# Altium schematic sheet STM32.SchDoc: Icarus MCU
size 431 x 279 mm; Date: 12/1/2022; DrawnBy: J. Sullivan; SheetNumber: 3; SheetTotal: 13; ENG_APP_DATE: 12/01/2022; DSN_APP_DATE: --/--/--; CHK_APP_DATE: --/--/--; SPICEModelCacheYFKOITNE: <root> / <DocumentId>YFKOITNE</DocumentId> / </root>
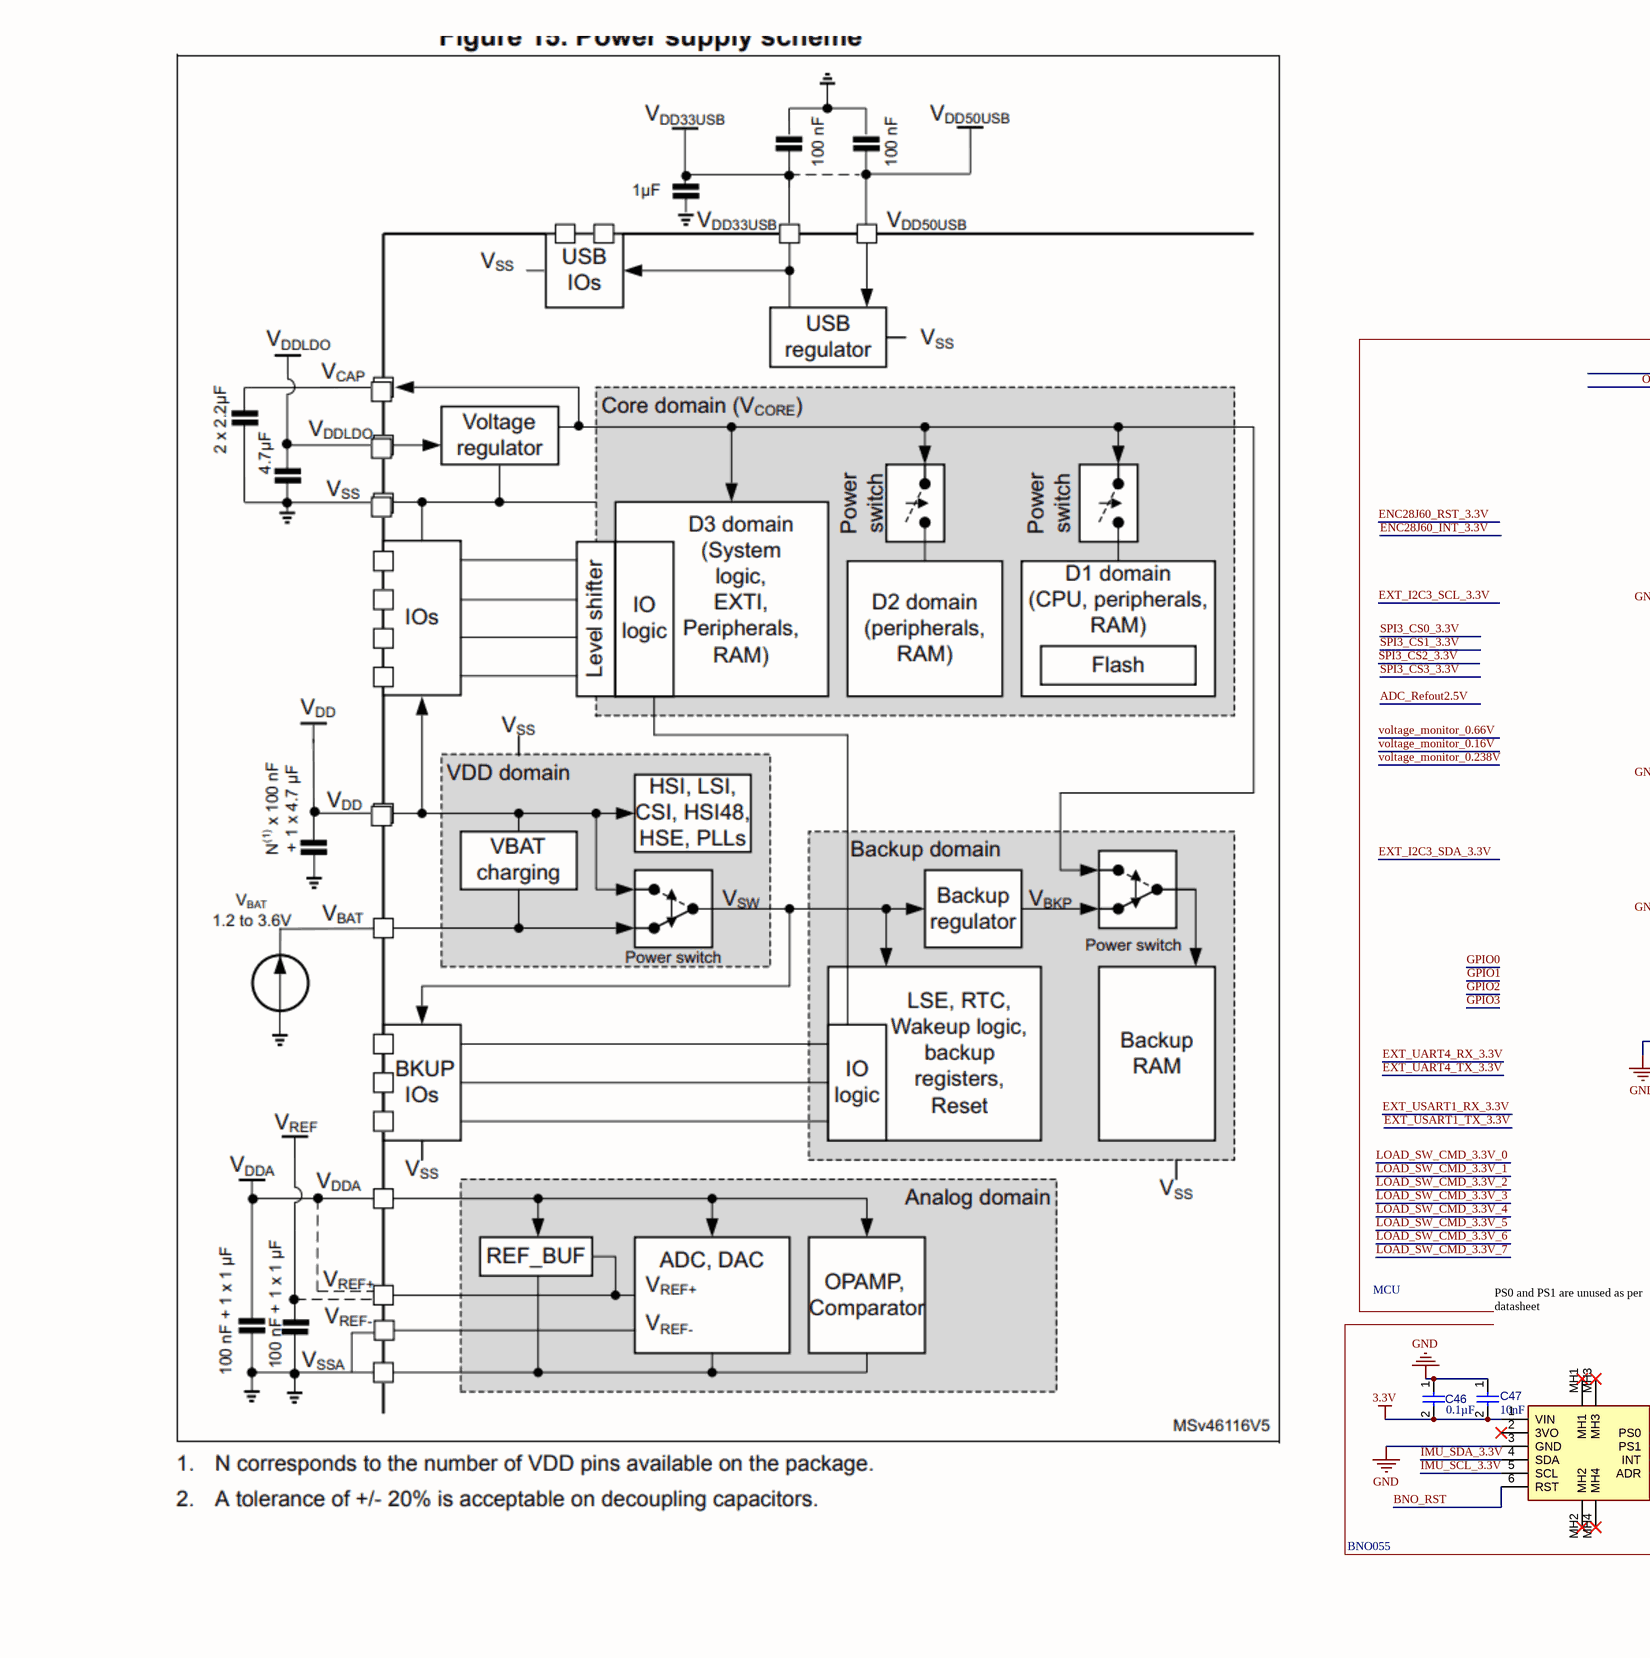
[diagram p0: STM32.SchDoc, left]
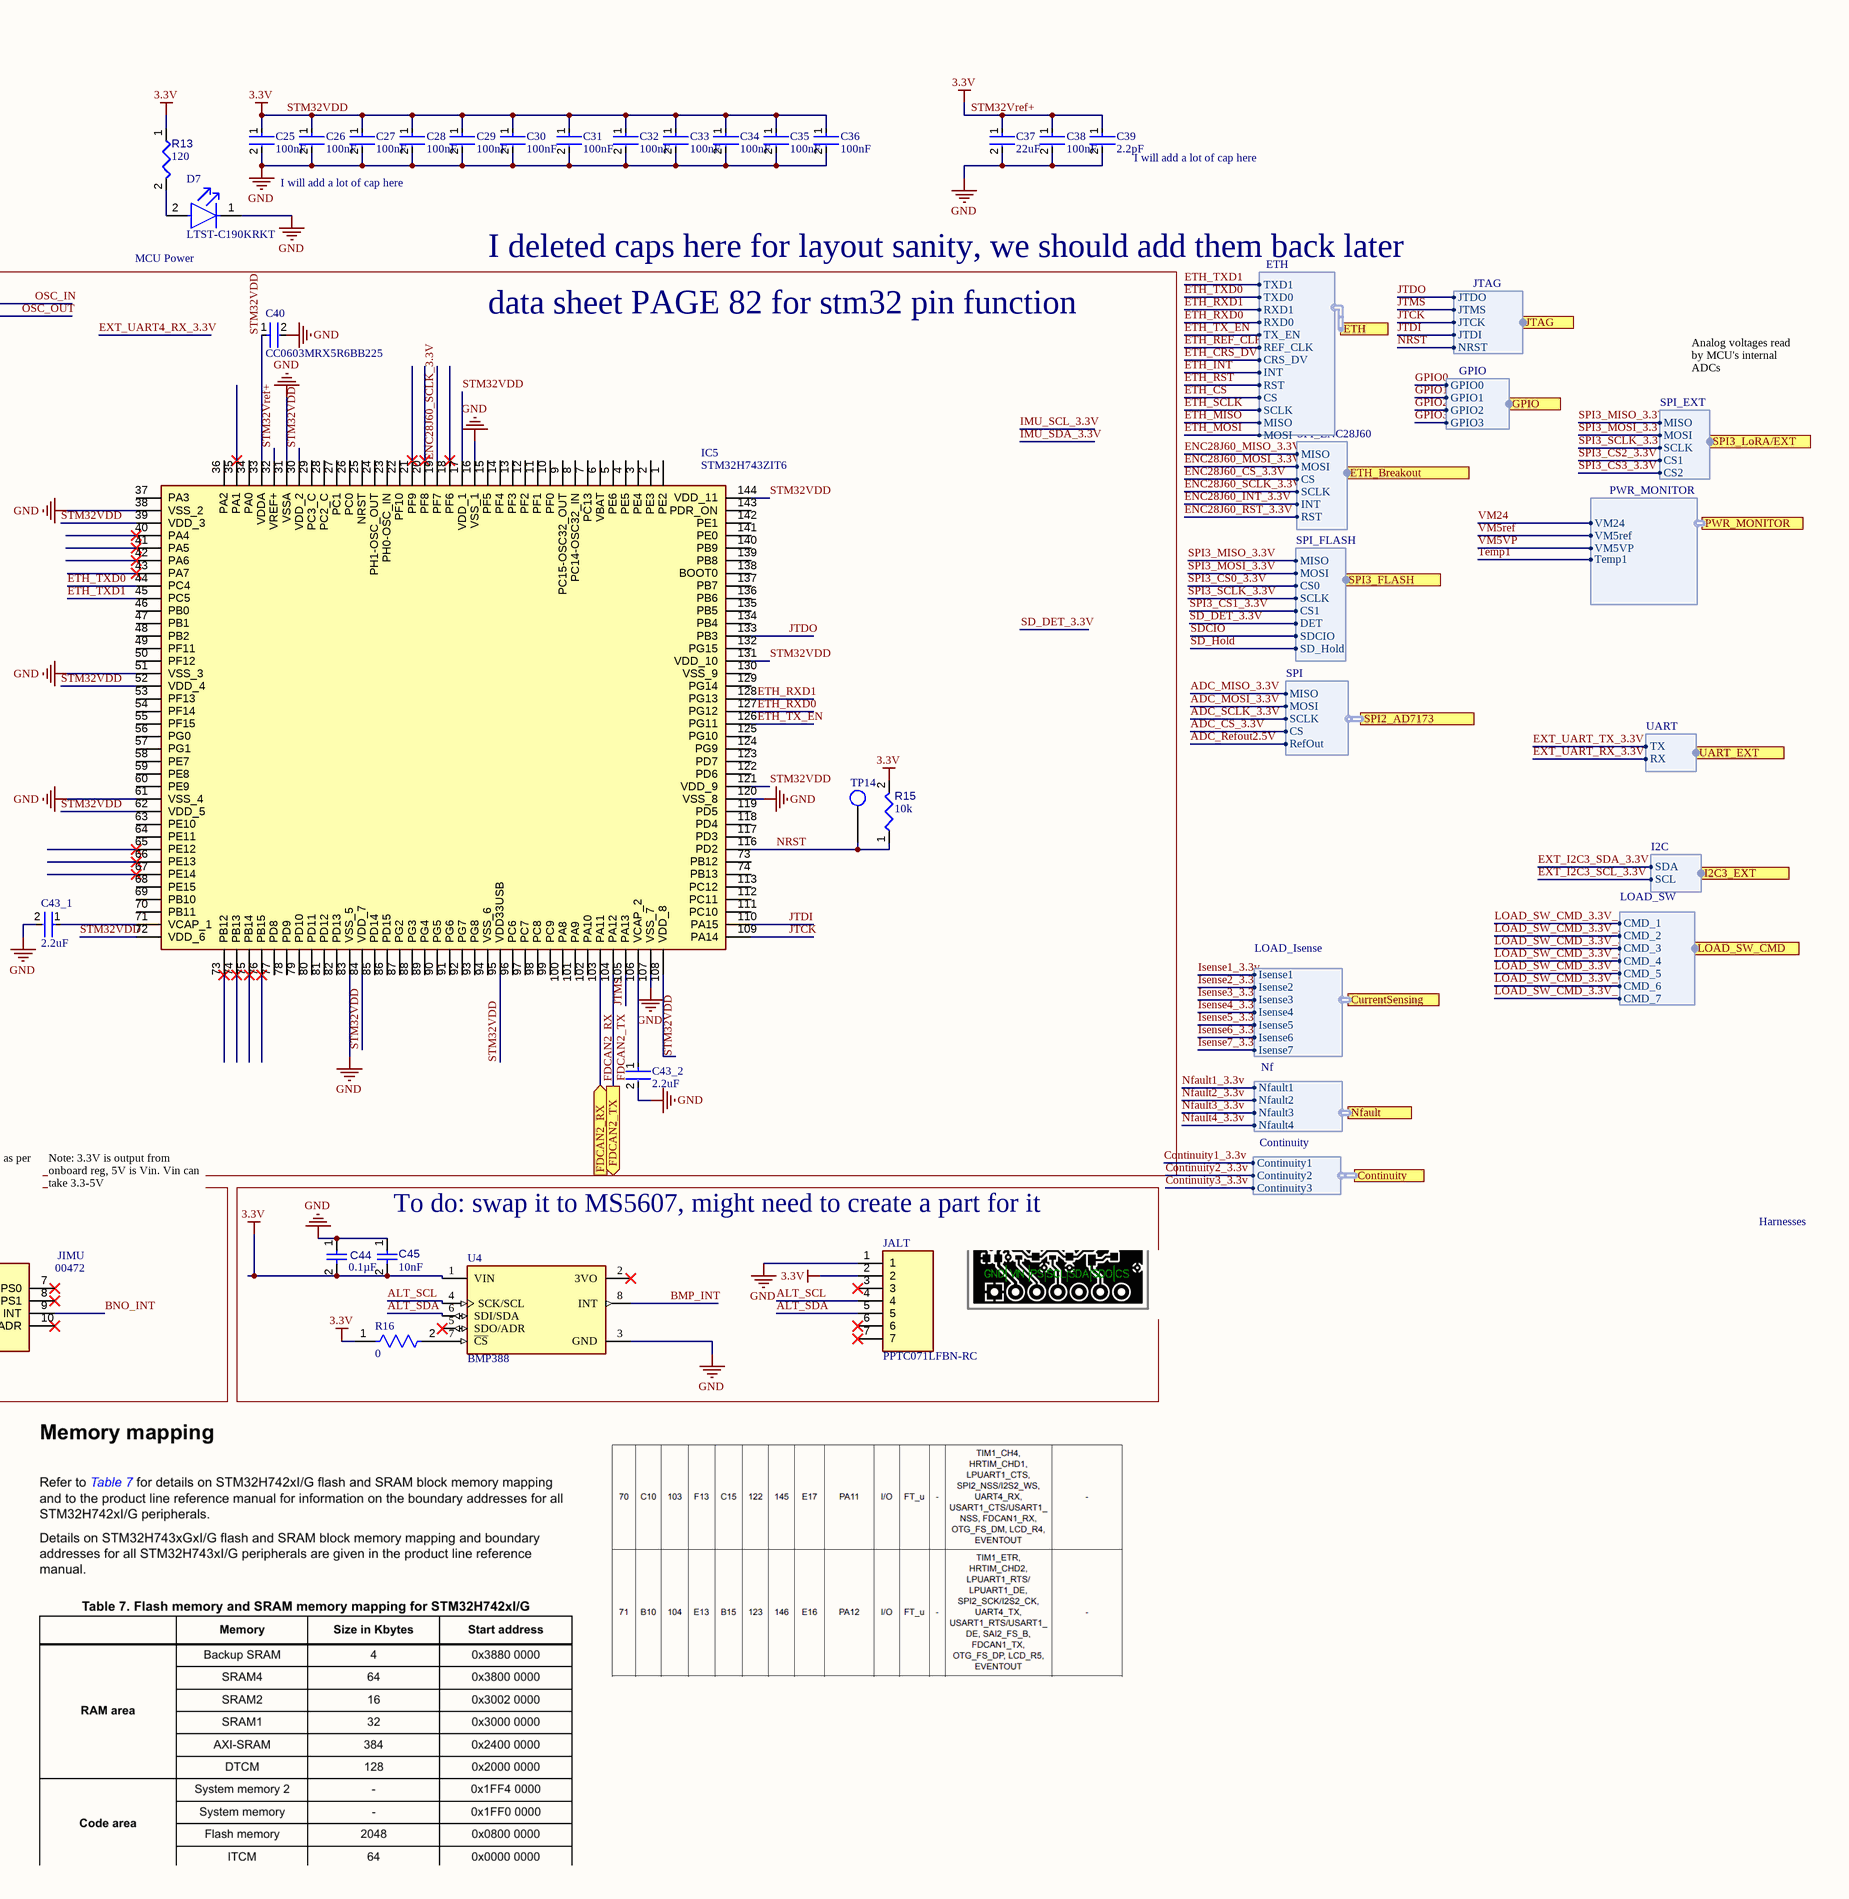
[diagram p1: STM32.SchDoc, right]

## Parts
C25  100nF  [FP-CC0402-MFG]
C26  100nF  [FP-CC0402-MFG]
C27  100nF  [FP-CC0402-MFG]
C28  100nF  [FP-CC0402-MFG]
C29  100nF  [FP-CC0402-MFG]
C30  100nF  [FP-CC0402-MFG]
C31  100nF  [FP-CC0402-MFG]
C32  100nF  [FP-CC0402-MFG]
C33  100nF  [FP-CC0402-MFG]
C34  100nF  [FP-CC0402-MFG]
C35  100nF  [FP-CC0402-MFG]
C36  100nF  [FP-CC0402-MFG]
C37  22uF  [FP-CC0603-DA-MFG]
C38  100nF  [FP-CGA3E-0_3-0_1-IPC_A]
C39  2.2pF  [FP-C0603C-CF-MFG]
C40  CC0603MRX5R6BB225  [FP-CC0603-DA-MFG]
C43_1  2.2uF  [FP-CC0603-DA-MFG]
C43_2  2.2uF  [FP-CC0603-DA-MFG]
C44  value 0.1µF  [CAPC1608X90X40LL10T20]  (hidden comment: Capacitor 1 uF +/- 10% 25 V 0603)
C45  value 10nF  [CAPC1608X90X40NL10T20]  (hidden comment: Capacitor 100 nF +/-10% 50 V 0603)
C46  value 0.1µF  [CAPC1608X90X40LL10T20]  (hidden comment: Capacitor 1 uF +/- 10% 25 V 0603)
C47  value 10nF  [CAPC1608X90X40NL10T20]  (hidden comment: Capacitor 100 nF +/-10% 50 V 0603)
D7  LTST-C190KRKT  [FP-LTST-C190KRKT-MFG]
IC5  STM32H743ZIT6  [QFP50P2200X2200X160-144N]
JALT  PPTC071LFBN-RC  [RHDR7W80P0X254_1X7_1828X254X870P]
JIMU  00472  [00472]
R13  value 120  [RESC1609X50X30ML08T20]  (hidden comment: Resistor 20R +/-1% 0603 100 mW)
R15  value 10k  [RESC0402(1005)_L]  (hidden comment: 10KR2F)
R16  0  [FP-CRCW1206-e3-MFG]
TP14  BURPG_TestPoint1  [BURPG_TestPoint1]  (value not drawn)  (no BOM)
U4  BMP388  [FP-3966-MFG]

## Blocks framed on the sheet
data sheet PAGE 82 for stm32 pin function: C40 C43_1 C43_2 IC5 R15 TP14
BNO055: C46 C47 JIMU
To do: swap it to MS5607, might need to create a part for it: C44 C45 JALT R16 U4

## Ports
Continuity (harness Continuity), CurrentSensing (harness LOAD_Isense), ETH (harness ETH), ETH_Breakout (harness SPI_ENC28J60), FDCAN2_RX (in), FDCAN2_TX (out), GPIO (harness GPIO), I2C3_EXT (harness I2C), JTAG (harness JTAG), LOAD_SW_CMD (harness LOAD_SW), Nfault (harness Nf), PWR_MONITOR (harness PWR_MONITOR), SPI2_AD7173 (harness SPI), SPI3_FLASH (harness SPI_FLASH), SPI3_LoRA/EXT (harness SPI_EXT), UART_EXT (harness UART)

## Harnesses
JTAG: JTDO, JTMS, JTCK, JTDI, NRST
UART: TX, RX
SPI_ENC28J60: MISO, MOSI, CS, SCLK, INT, RST
LOAD_SW: CMD_1, CMD_2, CMD_3, CMD_4, CMD_5, CMD_6, CMD_7
I2C: SDA, SCL
SPI_EXT: MISO, MOSI, CS1, SCLK, CS2
PWR_MONITOR: VM24, VM5ref, VM5VP, Temp1
GPIO: GPIO0, GPIO1, GPIO2, GPIO3
SPI_FLASH: MISO, MOSI, CS0, SCLK, CS1, DET, SDCIO, SD_Hold
SPI: MISO, MOSI, CS, SCLK, RefOut
LOAD_Isense: Isense1, Isense2, Isense3, Isense4, Isense5, Isense6, Isense7
Nf: Nfault1, Nfault2, Nfault3, Nfault4
Continuity: Continuity1, Continuity2, Continuity3
ETH: RXD0, RXD1, TXD0, TXD1, TX_EN, REF_CLK, CRS_DV, INT, RST, CS, SCLK, MISO, MOSI

## Nets
GND: C25.2 C26.2 C27.2 C28.2 C29.2 C30.2 C31.2 C32.2 C33.2 C34.2 C35.2 C36.2 C37.2 C38.2 C39.2 C40.2 C43_1.2 C43_2.2 C44.1 C45.1 C46.1 C47.1 D7.1(C) IC5.16(VSS_1) IC5.31(VSSA) IC5.38(VSS_2) IC5.51(VSS_3) IC5.61(VSS_4) IC5.83(VSS_5) IC5.107(VSS_7) IC5.120(VSS_8) JALT.1 JIMU.3(GND) U4.3(GND)
STM32VDD: C25.1 C26.1 C27.1 C28.1 C29.1 C30.1 C31.1 C32.1 C33.1 C34.1 C35.1 C36.1 C37.1 C38.1 C39.1 C40.1 C44.2 C45.2 C46.2 C47.2 IC5.17(VDD_1) IC5.30(VDD_2) IC5.32(VREF+) IC5.33(VDDA) IC5.39(VDD_3) IC5.52(VDD_4) IC5.62(VDD_5) IC5.72(VDD_6) IC5.84(VDD_7) IC5.95(VDD33USB) IC5.108(VDD_8) IC5.121(VDD_9) IC5.131(VDD_10) IC5.144(VDD_11) JALT.2 JIMU.1(VIN) R13.1 R15.2 R16.1 U4.1(VIN)  [also labelled 3.3V, STM32Vref+]
ADC_CS_3.3V: port SPI2_AD7173.CS
ADC_MISO_3.3V: port SPI2_AD7173.MISO
ADC_MOSI_3.3V: port SPI2_AD7173.MOSI
ADC_Refout2.5V: port SPI2_AD7173.RefOut
ADC_SCLK_3.3V: port SPI2_AD7173.SCLK
ALT_SCL: JALT.4 U4.4(SCK/SCL)
ALT_SDA: JALT.5 U4.6(SDI/SDA)
BMP_INT: U4.8(INT)
BNO_INT: JIMU.9(INT)
BNO_RST: JIMU.6(RST)
Continuity1_3.3v: port Continuity.Continuity1
Continuity2_3.3v: port Continuity.Continuity2
Continuity3_3.3v: port Continuity.Continuity3
ENC28J60_CS_3.3V: port ETH_Breakout.CS
ENC28J60_INT_3.3V: port ETH_Breakout.INT
ENC28J60_MISO_3.3V: port ETH_Breakout.MISO
ENC28J60_MOSI_3.3V: port ETH_Breakout.MOSI
ENC28J60_RST_3.3V: port ETH_Breakout.RST
ENC28J60_SCLK_3.3V: IC5.19(PF7) ; port ETH_Breakout.SCLK
ETH_CRS_DV: port ETH.CRS_DV
ETH_CS: port ETH.CS
ETH_INT: port ETH.INT
ETH_MISO: port ETH.MISO
ETH_MOSI: port ETH.MOSI
ETH_REF_CLK: port ETH.REF_CLK
ETH_RST: port ETH.RST
ETH_RXD0: IC5.127(PG12) ; port ETH.RXD0
ETH_RXD1: IC5.128(PG13) ; port ETH.RXD1
ETH_SCLK: port ETH.SCLK
ETH_TX_EN: IC5.126(PG11) ; port ETH.TX_EN
ETH_TXD0: IC5.44(PC4) ; port ETH.TXD0
ETH_TXD1: IC5.45(PC5) ; port ETH.TXD1
EXT_I2C3_SCL_3.3V: port I2C3_EXT.SCL
EXT_I2C3_SDA_3.3V: port I2C3_EXT.SDA
EXT_UART_RX_3.3V: port UART_EXT.RX
EXT_UART_TX_3.3V: port UART_EXT.TX
FDCAN2_RX: IC5.103(PA11) ; port FDCAN2_RX
FDCAN2_TX: IC5.104(PA12) ; port FDCAN2_TX
GPIO0: port GPIO.GPIO0
GPIO1: port GPIO.GPIO1
GPIO2: port GPIO.GPIO2
GPIO3: port GPIO.GPIO3
IMU_SCL_3.3V: JIMU.5(SCL)
IMU_SDA_3.3V: JIMU.4(SDA)
Isense1_3.3v: port CurrentSensing.Isense1
Isense2_3.3v: port CurrentSensing.Isense2
Isense3_3.3v: port CurrentSensing.Isense3
Isense4_3.3v: port CurrentSensing.Isense4
Isense5_3.3v: port CurrentSensing.Isense5
Isense6_3.3v: port CurrentSensing.Isense6
Isense7_3.3v: port CurrentSensing.Isense7
JTCK: IC5.109(PA14) ; port JTAG.JTCK
JTDI: IC5.110(PA15) ; port JTAG.JTDI
JTDO: IC5.133(PB3) ; port JTAG.JTDO
JTMS: IC5.105(PA13) ; port JTAG.JTMS
LOAD_SW_CMD_3.3V_1: port LOAD_SW_CMD.CMD_1
LOAD_SW_CMD_3.3V_2: port LOAD_SW_CMD.CMD_2
LOAD_SW_CMD_3.3V_3: port LOAD_SW_CMD.CMD_3
LOAD_SW_CMD_3.3V_4: port LOAD_SW_CMD.CMD_4
LOAD_SW_CMD_3.3V_5: port LOAD_SW_CMD.CMD_5
LOAD_SW_CMD_3.3V_6: port LOAD_SW_CMD.CMD_6
LOAD_SW_CMD_3.3V_7: port LOAD_SW_CMD.CMD_7
Nfault1_3.3v: port Nfault.Nfault1
Nfault2_3.3v: port Nfault.Nfault2
Nfault3_3.3v: port Nfault.Nfault3
Nfault4_3.3v: port Nfault.Nfault4
NRST: IC5.116(PD2) R15.1 TP14.1 ; port JTAG.NRST
SD_DET_3.3V: port SPI3_FLASH.DET
SD_Hold: port SPI3_FLASH.SD_Hold
SDCIO: port SPI3_FLASH.SDCIO
SPI3_CS0_3.3V: port SPI3_FLASH.CS0
SPI3_CS1_3.3V: port SPI3_FLASH.CS1
SPI3_CS2_3.3V: port SPI3_LoRA/EXT.CS1
SPI3_CS3_3.3V: port SPI3_LoRA/EXT.CS2
SPI3_MISO_3.3V: port SPI3_LoRA/EXT.MISO, port SPI3_FLASH.MISO
SPI3_MOSI_3.3V: port SPI3_LoRA/EXT.MOSI, port SPI3_FLASH.MOSI
SPI3_SCLK_3.3V: port SPI3_LoRA/EXT.SCLK, port SPI3_FLASH.SCLK
Temp1: port PWR_MONITOR.Temp1
VM5ref: port PWR_MONITOR.VM5ref
VM5VP: port PWR_MONITOR.VM5VP
VM24: port PWR_MONITOR.VM24
NetC43_1_1: C43_1.1 IC5.71(VCAP_1)
NetC43_2_1: C43_2.1 IC5.106(VCAP_2)
NetD7_2: D7.2(A) R13.2
NetR16_2: R16.2 U4.7(~{CS})

Not connected (* = marked no-connect by the designer): IC5 1(PE2) 2(PE3) 3(PE4) 4(PE5) 5(PE6) 6(VBAT) 7(PC13) 8(PC14-OSC32_IN) 9(PC15-OSC32_OUT) 10(PF0) 11(PF1) 12(PF2) 13(PF3) 14(PF4) 15(PF5) 18(PF6)* 20(PF8)* 21(PF9)* 22(PF10) 23(PH0-OSC_IN) 24(PH1-OSC_OUT) 25(NRST) 26(PC0) 27(PC1) 28(PC2_C) 29(PC3_C) 34(PA0) 35(PA1)* 36(PA2) 37(PA3) 40(PA4)* 41(PA5)* 42(PA6)* 43(PA7)* 46(PB0) 47(PB1) 48(PB2) 49(PF11) 50(PF12) 53(PF13) 54(PF14) 55(PF15) 56(PG0) 57(PG1) 58(PE7) 59(PE8) 60(PE9) 63(PE10) 64(PE11) 65(PE12)* 66(PE13)* 67(PE14)* 68(PE15) 69(PB10) 70(PB11) 73(PB12)* 74(PB13)* 75(PB14)* 76(PB15)* 77(PD8) 78(PD9) 79(PD10) 80(PD11) 81(PD12) 82(PD13) 85(PD14) 86(PD15) 87(PG2) 88(PG3) 89(PG4) 90(PG5) 91(PG6) 92(PG7) 93(PG8) 94(VSS_6) 96(PC6) 97(PC7) 98(PC8) 99(PC9) 100(PA8) 101(PA9) 102(PA10) 111(PC10) 112(PC11) 113(PC12) 117(PD3) 118(PD4) 119(PD5) 122(PD6) 123(PD7) 124(PG9) 125(PG10) 129(PG14) 130(VSS_9) 132(PG15) 134(PB4) 135(PB5) 136(PB6) 137(PB7) 138(BOOT0) 139(PB8) 140(PB9) 141(PE0) 142(PE1) 143(PDR_ON); JALT 3* 6* 7*; JIMU 2(3VO)* 7(PS0)* 8(PS1)* 10(ADR)* MH1* MH2* MH3* MH4*; U4 2(3VO)* 5(SDO/ADR)*

## Notes on the sheet
- I will add a lot of cap here
- (near C39) I will add a lot of cap here
- (near D7) MCU Power
- I deleted caps here for layout sanity, we should add them back later
- Analog voltages read by MCU's internal ADCs
- MCU
- PS0 and PS1 are unused as per datasheet
- Note: 3.3V is output from onboard reg, 5V is Vin. Vin can take 3.3-5V
- Harnesses
- DWG. NO.
- REV.
- SHT.
- THIS DOCUMENT AND THE DATA DISCLOSED HEREIN OR HEREWITH IS THE PROPERTY OF ALTIUM LIMITED AND MAY BE FREELY DISTRIBUTED IN WHOLE. NO RIGHTS ARE RESERVED OR EXPRESS OR IMPLIED WARANTEE GIVEN.
- REVISION
- DESCRIPTION
- DATE
- APPROVED
- ENG:
- APPROVALS
- PROJECT
- DSN:
- CHK:
- REFERENCE DOCUMENTS
- PROJECT REVISION:
- TITLE
- DOCUMENT REVISION:
- DESIGN ITEM:
- BOM:
- FAB DWG:
- PCB DWG:
- ASSY DWG:
- SCALE:
- SIZE
- B
- CAGE CODE
- FILE NAME
- DWG NO.
- SHEET
- OF
- REV

## Library data of the parts
C25-C36 = CMP-03422-000048-1: CAP CER 0.1UF 16V X7R 0402; Manufacturer: YAGEO; Manufacturer Part Number: CC0402KRX7R7BB104; Material: Ceramic; Automotive Grade: NA; Temperature Coefficient: 30ppm/°C; Tolerance: 0.1; Device Class L1: Passive Components; Temperature Range Low: -55°C; Device Class L3: Ceramic Capacitors; Temperature Characteristic: X7R; Ipc Land Pattern Name: CAPC10050X50; Capacitance: 100 nF; Temperature Range High: +125°C; Voltage Rating: 16 V; Temperature: -55°C to +125°C; RoHS: TRUE; Automotive: No; Height: 0.55mm; Device Class L2: Capacitors; Digikey Description: CAP CER 0.1UF 16V X7R 0402; Package: CC0402; Footprint Url: http://www.yageo.com/exep/pages/download/literatures/UPY-C_GEN_24.pdf; ComponentLink2Description: Datasheet; Category: Cap; Lead Free: Yes; Value: 100 nF; Octopart: https://octopart.com/cc0402krx7r7bb104-yageo-42244624; ComponentLink2URL: http://www.yageo.com/documents/recent/UPY-GP_NP0_16V-to-50V_16.pdf; Mouser Description: 0402 0.1 uF 16 V ±10 % Tolerance X7R SMT Multilayer Ceramic Capacitor
C37 C43_1 C43_2 = CMP-03422-000441-1: CAP CER 2.2UF 10V X5R 0603; Manufacturer Part Number: CC0603MRX5R6BB225; Manufacturer: YAGEO; Material: Ceramic; Tolerance: 0.2; Temperature Coefficient: 15%; Temperature Characteristic: X5R; Device Class L2: Capacitors; Octopart: https://octopart.com/cc0603mrx5r6bb225-yageo-40952238; Digikey Description: CAP CER 2.2UF 10V X5R 0603; Footprint Url: http://www.yageo.com/exep/pages/download/literatures/UPY-C_GEN_24.pdf; ComponentLink2URL: http://www.yageo.com/documents/recent/UPY-GPHC_X7R_6.3V-to-50V_18.pdf; ComponentLink2Description: Datasheet; Device Class L1: Passive Components; Height: 0.9mm; Category: Cap; Device Class L3: Ceramic Capacitors; Temperature Range High: +125°C; Value: 2.2 uF; Automotive: No; Package: CC0603-DA; Mouser Description: Multilayer Ceramic Capacitors MLCC - SMD/SMT 2.2uF 10V X5R 20%; Temperature: -55°C to +125°C; Temperature Range Low: -55°C; RoHS: TRUE; Lead Free: Yes; Voltage Rating: 10 V; Capacitance: 2.2 uF; Voltage: 10 V
C38 = CMP-2000-07546-2: Cap Ceramic 100nF 50V X7R 10% Pad SMD 0603 +125°C Automotive T/R; Weight: 7.1E-05oz; Composition: Ceramic; Max Operating Temperature: 125°C; Termination: SMD/SMT; Dielectric: X7R; Length: 1.6mm; Package Quantity: 1; REACH SVHC: No SVHC; Lead Free: Lead Free; Case Code (Metric): 1608; Min Operating Temperature: -55°C; Packaging: Tape and Reel; Tolerance: 10%; Voltage Rating: 50V; Case Code (Imperial): 0603; Capacitance: 100nF; Case/Package: 0603; Voltage Rating (DC): 50V; Depth: 0.8mm; Radiation Hardening: No; Ratings: AEC-Q200; Mount: Surface Mount; Voltage: 50V; Thickness: 0.035inch; Width: 0.8mm; Height: 0.8mm
C39 = CMP-1035-00158-3: CAP CER 2.2PF 50V NP0 0603; Manufacturer Part Number: C0603C229C5GACTU; Manufacturer: KEMET; Automotive Grade: Grade 1; Temperature Coefficient: 30ppm/°C; Temperature Characteristic: C0G; Tolerance: 0.25 pF; Material: Ceramic; Lead Free: Yes; Value: 2.2 pF; Voltage Rating: 50 V; Package: C0603C-CF; Category: Cap; RoHS: TRUE; ComponentLink2Description: Datasheet; Capacitance: 2.2 pF; Device Class L2: Capacitors; Digikey Description: CAP CER 2.2PF 50V NP0 0603; Temperature: -55°C to +125°C; Temperature Range Low: -55°C; Mouser Description: Multilayer Ceramic Capacitors MLCC - SMD/SMT 50volts 2.2pF C0G 0.25%; ComponentLink2URL: https://api.kemet.com/component-edge/download/datasheet/C0603C100J5GACAUTO.pdf; Temperature Range High: +125°C; Height: 0.87mm; Automotive: Yes; Device Class L1: Passive Components; Octopart: https://octopart.com/c0603c229c5gactu-kemet-3874912; Device Class L3: Ceramic Capacitors
C40 = CMP-03422-000441-1: CAP CER 2.2UF 10V X5R 0603; Manufacturer: YAGEO; Material: Ceramic; Tolerance: 0.2; Temperature Coefficient: 15%; Temperature Characteristic: X5R; Device Class L2: Capacitors; Octopart: https://octopart.com/cc0603mrx5r6bb225-yageo-40952238; Digikey Description: CAP CER 2.2UF 10V X5R 0603; Footprint Url: http://www.yageo.com/exep/pages/download/literatures/UPY-C_GEN_24.pdf; ComponentLink2URL: http://www.yageo.com/documents/recent/UPY-GPHC_X7R_6.3V-to-50V_18.pdf; ComponentLink2Description: Datasheet; Device Class L1: Passive Components; Height: 0.9mm; Category: Cap; Device Class L3: Ceramic Capacitors; Temperature Range High: +125°C; Value: 2.2 uF; Manufacturer Part Number: CC0603MRX5R6BB225; Automotive: No; Package: CC0603-DA; Mouser Description: Multilayer Ceramic Capacitors MLCC - SMD/SMT 2.2uF 10V X5R 20%; Temperature: -55°C to +125°C; Temperature Range Low: -55°C; RoHS: TRUE; Lead Free: Yes; Voltage Rating: 10 V; Capacitance: 2.2 uF; Voltage: 10 V
C44 C46 = CMP-001-00005-6: Chip Capacitor, 1 uF, +/- 10%, 25 V, 0603 (1608 Metric); Capacitor Type: Ceramic; Voltage Rating: 25V; Pins: 2; Mounting Technology: SM; RoHS Compliant: True; Max Operating Temperature: 125°C; Case/Package: 0603; Min Operating Temperature: -55°C; Tolerance: 10%
C45 C47 = CMP-001-00017-6: Chip Capacitor, 100 nF, +/- 10%, 50 V, 0603 (1608 Metric); Voltage Rating: 50V; Capacitor Type: Ceramic; Tolerance: 10%; Mounting Technology: SM; Max Operating Temperature: 125°C; RoHS Compliant: True; Pins: 2; Case/Package: 0603; Min Operating Temperature: -55°C
D7 = CMP-1674-00011-2: LED RED CLEAR CHIP SMD; Reverse Voltage: 5V; Viewing Angle: 130°; Power Rating: 75mW; Test Current: 20mA; Number of Elements: 1; Lens Color: Colorless; Wavelength: 639nm; Dominant Wavelength: 631nm; Lens Style: Diffused; Forward Current: 30mA; Forward Voltage: 2.4V; Luminous Intensity: 54mcd; Color: Red; Case Code (Imperial): 0603; Lens Transparency: Clear; Lead Free: Lead Free; Package Quantity: 1; Packaging: Tape and Reel; Max Operating Temperature: 85°C; Number of Pins: 2; Height: 0.8mm; Case/Package: 0603; Number of LEDs: 1; Width: 0.8mm; Case Code (Metric): 1608; Depth: 0.8mm; Mount: Surface Mount; Radiation Hardening: No; Length: 1.6mm; Illumination Color: Red; Power Dissipation: 75mW; Min Operating Temperature: -55°C
IC5 = STM32H743ZIT6: Integrated Circuit / https://www.allelcoelec.com/productdetails/STMicroelectronics/STM32H743ZIT6.html?gad_source=1&gad_campaignid=21002909653&gclid=CjwKCAjw4efDBhATEiwAaDBpbvLpcbmne3WKOXgEcIaqaVpz5lcgSvxb9vCyHUjI6dfgnmkW9JZCHhoCY-cQAvD_BwE; Datasheet Link: https://www.st.com/resource/en/datasheet/stm32h743zi.pdf; Height: 1.6mm; Manufacturer_Name: STMicroelectronics; Manufacturer_Part_Number: STM32H743ZIT6; Mouser Part Number: 511-STM32H743ZIT6; Mouser Price/Stock: https://www.mouser.co.uk/ProductDetail/STMicroelectronics/STM32H743ZIT6?qs=FNcb6ahWXRyuf15GdgTu%252Bw%3D%3D; Arrow Part Number: STM32H743ZIT6; Arrow Price/Stock: https://www.arrow.com/en/products/stm32h743zit6/stmicroelectronics?utm_currency=USD&region=nac
JALT = PPTC071LFBN-RC: Connector; Manufacturer_Name: Sullins; Datasheet Link: https://drawings-pdf.s3.amazonaws.com/10492.pdf; Height: 8.7mm; Manufacturer_Part_Number: PPTC071LFBN-RC
JIMU = 00472: Connector; Manufacturer_Name: Adafruit; Datasheet Link: https://learn.adafruit.com/downloads/pdf/adafruit-bno055-absolute-orientation-sensor.pdf; Height: 2mm; Manufacturer_Part_Number: 00472
R13 = CMP-009-00199-1: Chip Resistor, 20 Ohm, +/- 1%, 100 mW, -55 to 155 degC, 0603 (1608 Metric); Power: 100mW; Voltage Rating: 75V; RoHS Compliant: True; Tolerance: 1%; Mounting Technology: SM; Min Operating Temperature: -55°C; Pins: 2; Max Operating Temperature: 155°C; Case/Package: 0603
R15 = CMP-009-00066-2: 10K 0.063W 1% 0402 (1005 Metric)  SMD; Power: 63mW; Case/Package: 0402; Mounting Technology: SMT; Pins: 2; Tolerance: 1%
R16 = CMP-2003-04797-2: RES Thick Film, 0Ω, 0.25W, 1206; Voltage Rating: 200V; Power Rating: 250mW; Resistance: 0mR; Depth: 1.6mm; Case/Package: 1206; Termination: SMD/SMT; Military Standard: Not; Length: 3.2mm; Height: 0.024inch; Number of Terminations: 2; Case Code (Metric): 3216; Width: 0.063inch; Features: Automotive AEC-Q200; Max Operating Temperature: 155°C; Min Operating Temperature: -55°C; Voltage Rating (DC): 200V; Contact Plating: Tin; Max Power Dissipation: 250mW; Radiation Hardening: No; Packaging: Tape and Reel; Package Quantity: 10000; Composition: Thick Film; Weight: 0.000353oz; Case Code (Imperial): 1206; Lead Free: Lead Free
U4 = CMP-144239-000001-1: BMP388 - PRECISION BAROMETRIC PR